# Altium schematic sheet SINUX_V3_IO.SchDoc
size 594 x 420 mm
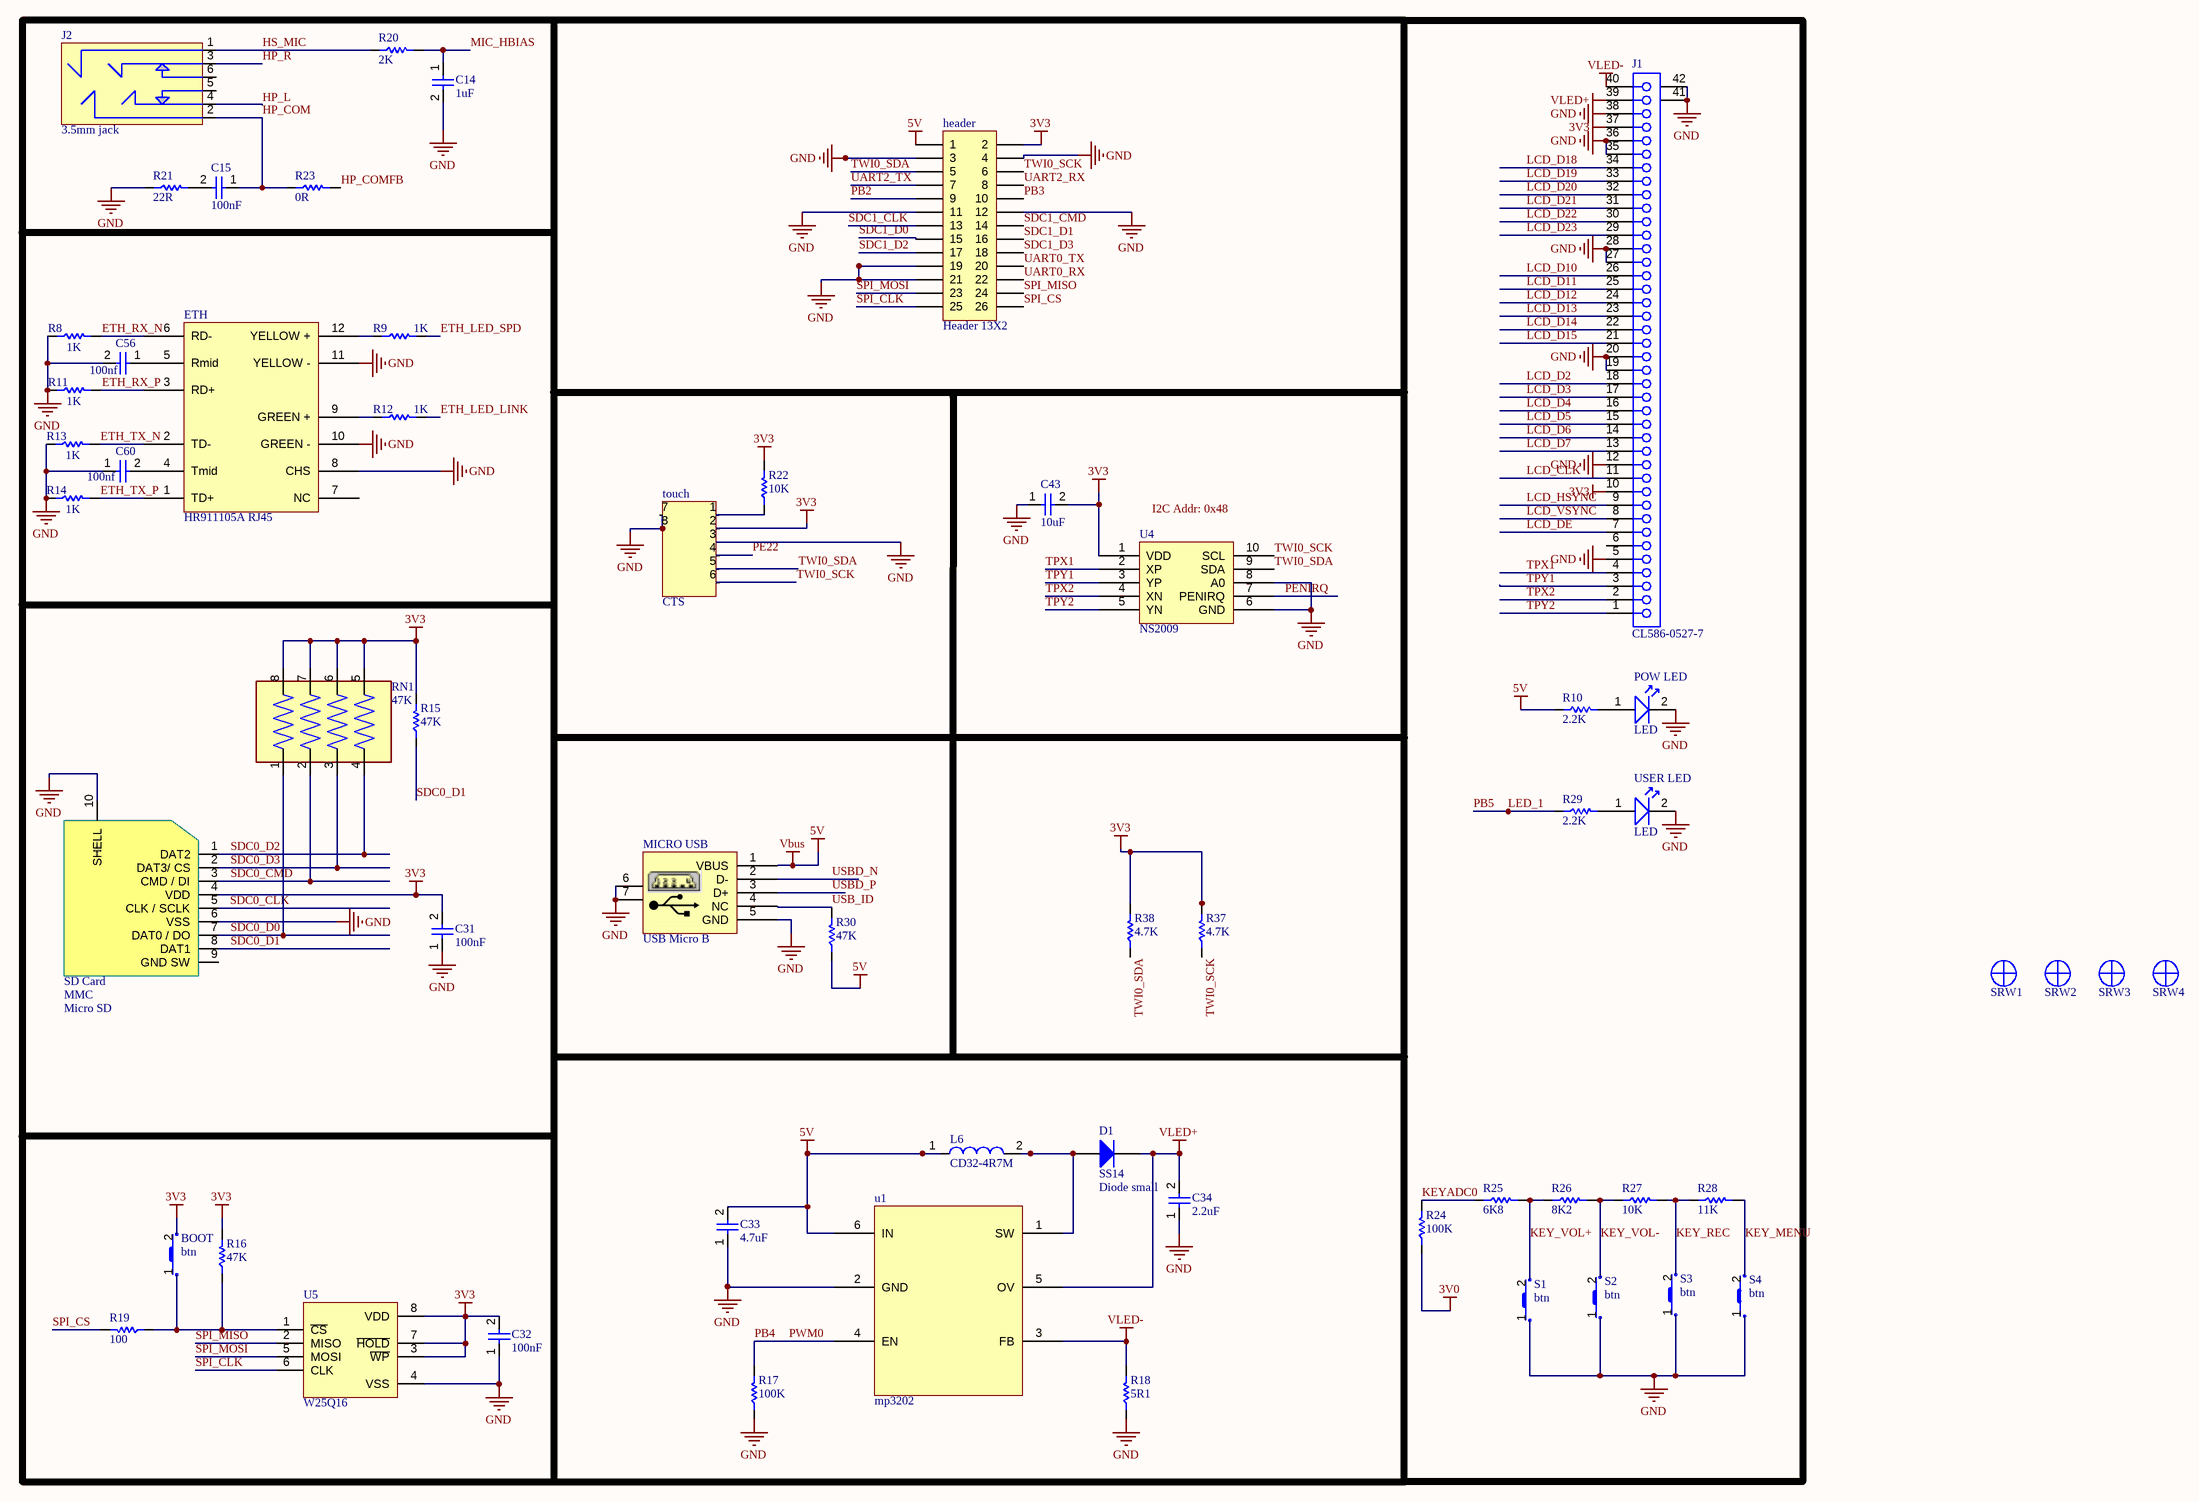
[diagram p0: SINUX_V3_IO.SchDoc]

## Parts
BOOT  btn  [btn]
C14  1uF  [SMD 0805]
C15  100nF  [SMD 0805]
C31  100nF  [SMD 0805]
C32  100nF  [SMD 0805]
C33  4.7uF  [SMD 0805]
C34  2.2uF  [SMD 0805]
C43  10uF  [SMD 0805]
C56  100nf  [SMD 0805]
C60  100nf  [SMD 0805]
D1  SS14  [Diode small SMD]
ETH  HR911105A RJ45  [HR911105A]
header  Header 13X2  [HDR2X13]
J1  CL586-0527-7  [FH12-40S-0.5SH]
J2  3.5mm jack  [3.5mm jack 6 pin]
L6  CD32-4R7M  [CD324R7M]
MICRO_USB  USB Micro B  [USB mini]
POW_LED  LED  [0805 LED]
R8  1K  [0805_1/8W]
R9  1K  [0805_1/8W]
R10  2.2K  [0805_1/8W]
R11  1K  [0805_1/8W]
R12  1K  [0805_1/8W]
R13  1K  [0805_1/8W]
R14  1K  [0805_1/8W]
R15  47K  [0805_1/8W]
R16  47K  [0805_1/8W]
R17  100K  [0805_1/8W]
R18  5R1  [0805_1/8W]
R19  100  [0805_1/8W]
R20  2K  [0805_1/8W]
R21  22R  [0805_1/8W]
R22  10K  [0805_1/8W]
R23  0R  [0805_1/8W]
R24  100K  [0805_1/8W]
R25  6K8  [0805_1/8W]
R26  8K2  [0805_1/8W]
R27  10K  [0805_1/8W]
R28  11K  [0805_1/8W]
R29  2.2K  [0805_1/8W]
R30  47K  [0805_1/8W]
R37  4.7K  [0805_1/8W]
R38  4.7K  [0805_1/8W]
RN1  47K  [RESCAF80P320X160X60-8N]
S1  btn  [btn]
S2  btn  [btn]
S3  btn  [btn]
S4  btn  [btn]
SD_Card  MMC  [Micro SD holder]
SRW1  Screw  [Board Screw]  (value not drawn)
SRW2  Screw  [Board Screw]  (value not drawn)
SRW3  Screw  [Board Screw]  (value not drawn)
SRW4  Screw  [Board Screw]  (value not drawn)
touch  CTS  [TS]
u1  mp3202  [SOP95P275X110-6N]
U4  NS2009  [SOP50P490X110-11N]
U5  W25Q16  [SOIC 8-Lead  (5.08mm)]
USER_LED  LED  [0805 LED]

## Nets
3V0: R24.1
3V3: BOOT.2 C31.2 C32.2 C43.2 header.2 J1.10 J1.37 R15.2 R16.2 R22.2 R37.2 R38.2 RN1.5 RN1.6 RN1.7 RN1.8 SD_Card.4(VDD) touch.2 U4.1(VDD) U5.3(~{WP}) U5.7(~{HOLD}) U5.8(VDD)
5V: C33.2 header.1 L6.1 MICRO_USB.1(VBUS) R10.1 R30.1 u1.6(IN)  [also labelled Vbus]
GND: C14.2 C31.1 C32.1 C33.1 C34.1 C43.1 C56.2 C60.1 ETH.8(CHS) ETH.10(GREEN_-) ETH.11(YELLOW_-) header.3 header.4 header.11 header.12 header.19 header.21 J1.5 J1.12 J1.19 J1.20 J1.27 J1.28 J1.35 J1.36 J1.38 J1.41(MH1) J1.42(MH2) MICRO_USB.5(GND) MICRO_USB.6 MICRO_USB.7 POW_LED.2 R8.1 R11.1 R13.1 R14.1 R17.1 R18.1 R21.1 S1.1 S2.1 S3.1 S4.1 SD_Card.6(VSS) SD_Card.10(SHELL) touch.3 touch.7 touch.8 u1.2(GND) U4.6(GND) U4.8(A0) U5.4(VSS) USER_LED.2
VLED+: C34.2 D1.2(K) J1.39 u1.5(OV)
VLED-: J1.40 R18.2 u1.3(FB)
ETH_LED_LINK: R12.2
ETH_LED_SPD: R9.2
ETH_RX_N: ETH.6(RD-) R8.2
ETH_RX_P: ETH.3(RD+) R11.2
ETH_TX_N: ETH.2(TD-) R13.2
ETH_TX_P: ETH.1(TD+) R14.2
HP_COM: C15.1 J2.2 R23.1
HP_COMFB: R23.2
HP_L: J2.4
HP_R: J2.3
HS_MIC: J2.1 R20.1
KEY_MENU: R28.2 S4.2
KEY_REC: R27.2 R28.1 S3.2
KEY_VOL+: R25.2 R26.1 S1.2
KEY_VOL-: R26.2 R27.1 S2.2
KEYADC0: R24.2 R25.1
LCD_CLK: J1.11
LCD_D2: J1.18
LCD_D3: J1.17
LCD_D4: J1.16
LCD_D5: J1.15
LCD_D6: J1.14
LCD_D7: J1.13
LCD_D10: J1.26
LCD_D11: J1.25
LCD_D12: J1.24
LCD_D13: J1.23
LCD_D14: J1.22
LCD_D15: J1.21
LCD_D18: J1.34
LCD_D19: J1.33
LCD_D20: J1.32
LCD_D21: J1.31
LCD_D22: J1.30
LCD_D23: J1.29
LCD_DE: J1.7
LCD_HSYNC: J1.9
LCD_VSYNC: J1.8
LED_1: R29.1  [also labelled PB5]
MIC_HBIAS: C14.1 R20.2
PB2: header.9
PB3: header.10
PB4: R17.2 u1.4(EN)  [also labelled PWM0]
PE22: touch.4
PENIRQ: U4.7(PENIRQ)
SDC0_CLK: SD_Card.5(CLK_/_SCLK)
SDC0_CMD: RN1.2 SD_Card.3(CMD_/_DI)
SDC0_D0: RN1.1 SD_Card.7(DAT0_/_DO)
SDC0_D1: R15.1 SD_Card.8(DAT1)
SDC0_D2: RN1.4 SD_Card.1(DAT2)
SDC0_D3: RN1.3 SD_Card.2(DAT3/_CS)
SDC1_CLK: header.13
SDC1_CMD: header.14
SDC1_D0: header.15
SDC1_D1: header.16
SDC1_D2: header.17
SDC1_D3: header.18
SPI_CLK: header.25 U5.6(CLK)
SPI_CS: header.26 R19.2
SPI_MISO: header.24 U5.2(MISO)
SPI_MOSI: header.23 U5.5(MOSI)
TPX1: J1.4 U4.2(XP)
TPX2: J1.2 U4.4(XN)
TPY1: J1.3 U4.3(YP)
TPY2: J1.1 U4.5(YN)
TWI0_SCK: header.6 R37.1 touch.6 U4.10(SCL)
TWI0_SDA: header.5 R38.1 touch.5 U4.9(SDA)
UART0_RX: header.22
UART0_TX: header.20
UART2_RX: header.8
UART2_TX: header.7
USB_ID: MICRO_USB.4(NC) R30.2
USBD_N: MICRO_USB.2(D-)
USBD_P: MICRO_USB.3(D+)
NetBOOT_1: BOOT.1 R16.1 R19.1 U5.1(~{CS})
NetC15_2: C15.2 R21.2
NetC56_1: C56.1 ETH.5(Rmid)
NetC60_2: C60.2 ETH.4(Tmid)
NetD1_1: D1.1(A) L6.2 u1.1(SW)
NetETH_9: ETH.9(GREEN_+) R12.1
NetETH_12: ETH.12(YELLOW_+) R9.1
NetPOW_LED_1: POW_LED.1 R10.2
NetR22_1: R22.1 touch.1
NetR29_2: R29.2 USER_LED.1

Not connected (* = marked no-connect by the designer): ETH 7(NC); J1 6; J2 5 6; SD_Card 9(GND_SW)

## Notes on the sheet
- Labels drawn without touching a wire or pin: I2C Addr: 0x48
- DWG NO:
- REV:
- THIS DOCUMENT AND THE DATA DISCLOSED HEREIN OR
- HEREWITH IS THE PROPERTY OF ALTIUM LIMITED AND MAY
- BE FREELY DISTRIBUTED IN WHOLE. NO RIGHTS ARE
- RESERVED OR EXPRESS OR IMPLIED WARANTEE GIVEN.
- REVISION
- DESCRIPTION
- DATE
- APPROVED
- ENG:
- APPROVALS
- PROJECT
- DSN:
- CHK:
- REFERENCE DOCUMENTS
- PROJECT REVISION:
- TITLE
- DOCUMENT REVISION:
- DESIGN ITEM:
- BOM:
- FAB DWG:
- PCB DWG:
- ASSY DWG:
- SCALE:
- A2
- SIZE
- CAGE CODE
- FILE NAME
- DWG NO.
- SHEET
- OF
- REV
- (in symbol Diode) Diode small
- (in symbol MMC) Micro SD

## Library data of the parts
C14 C15 C32-C34 = CAP NON: Capacitor; Manufacturer Part Number 1: 10uF; Supplier 1: SMD-0805
C31 C43 C56 C60 = CAP NON
D1 = Diode
header = Header 13X2: Header, 13-Pin, Dual row; LatestRevisionDate: 17-Jul-2002; LatestRevisionNote: Re-released for DXP Platform.; Publisher: Altium Limited
J1 = CL586-0527-7: FH12 Series, "Flip-Lock" SMT/ZIF FFC/FPC Connector - 0.5mm Spaced Bottom Contact; Positions: 40; ContactMaterial: Phosphor Bronze; Current: 0.4A; PCB_Layout: Complies with manufacturer's recommendation.; Published: 17-Jul-2002; DatasheetVersion: 13-Nov-2000; PackageVersion: 13-Nov-2000; PackageReference: FH12-40S-0.5SH; Publisher: Altium Limited; PadDimensions: Follow nominal values, Suitable for Wave Soldering, Adjust for Re-flow.; ComponentLink1Description: Manufacturer Link; ComponentLink1URL: http://www.hiroseusa.com/; ComponentLink2Description: Datasheet; ComponentLink2URL: http://www.hirose.co.jp/cataloge_hp/e58605370.pdf
L6 = CD32-4R7M: Inductor; Manufacturer_Name: Shuo Xing; Datasheet Link: http://aitendo3.sakura.ne.jp/aitendo_data/product_img/parts/coil/CD32/CD32.pdf; Height: 2.4mm; Manufacturer_Part_Number: CD32-4R7M
R8-R30 R37 R38 = RESISTOR
RN1 = CAY16-270J4LF: 27 Ohm Â±5% 62.5mW Power Per Element Isolated Resistor Network/Array Â±200ppm/Â°C 1206 (3216 Metric), Convex, Long Side Terminals; MF: Bourns; Purchase-URL: https://pricing.snapeda.com/search/part/CAY16-270J4LF/?ref=eda; MP: CAY16-270J4LF; Package: 1206 Bourns; Price: None; Availability: Good; SnapEDA_Link: https://www.snapeda.com/parts/CAY16-270J4LF/Bourns/view-part/1118422/?ref=snap; Value: *; Check_prices: https://www.snapeda.com/parts/CAY16-270J4LF/Bourns/view-part/1118422/?ref=eda
SRW1-SRW4 = Board Screw 3MM: Board Screw With Spacer
U5 = SST25VF032: SERIAL FLASH MEMORY; Manufacturer Part Number 1: W25Q32JV-DTR; Manufacturer 1: Winbond; Supplier 1: 8-Pin SOIC 208-mil